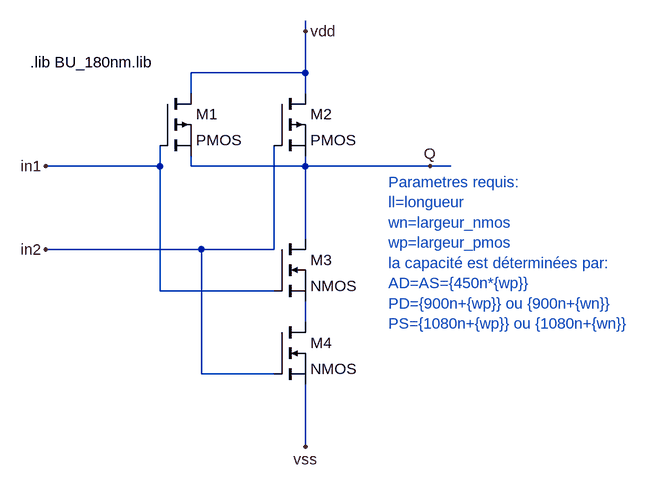
[diagram p0: schematic nand.asc]
nand.asc, the LTspice schematic file:
Version 4
SHEET 1 1192 980
WIRE 448 160 448 144
WIRE 448 224 448 160
WIRE 448 224 272 224
WIRE 272 256 272 224
WIRE 448 256 448 224
WIRE 224 368 224 336
WIRE 224 368 48 368
WIRE 272 368 272 352
WIRE 448 368 448 352
WIRE 448 368 272 368
WIRE 640 368 448 368
WIRE 672 368 640 368
WIRE 448 480 448 368
WIRE 288 496 48 496
WIRE 400 496 400 336
WIRE 400 496 288 496
WIRE 224 560 224 368
WIRE 400 560 224 560
WIRE 448 608 448 576
WIRE 288 688 288 496
WIRE 400 688 288 688
WIRE 448 800 448 704
FLAG 448 160 vdd
FLAG 448 800 vss
FLAG 640 368 Q
FLAG 48 368 in1
FLAG 48 496 in2
SYMBOL pmos 224 256 R0
SYMATTR InstName M1
SYMBOL pmos 400 256 R0
SYMATTR InstName M2
SYMBOL nmos 400 480 R0
SYMATTR InstName M3
SYMBOL nmos 400 608 R0
SYMATTR InstName M4
TEXT 24 208 Left 2 !.lib BU_180nm.lib
TEXT 576 392 Left 2 ;Parametres requis: \nll=longueur \nwn=largeur_nmos \nwp=largeur_pmos\nla capacité est déterminées par:     \nAD=AS={450n*{wp}}\nPD={900n+{wp}} ou {900n+{wn}}\nPS={1080n+{wp}} ou {1080n+{wn}}

The netlist it stands for:
* nand.asc
M1 vdd in1 Q Q PMOS
M2 vdd in2 Q Q PMOS
M3 Q in1 N001 N001 NMOS
M4 N001 in2 vss vss NMOS
.model NMOS NMOS
.model PMOS PMOS
.lib standard.mos
.lib BU_180nm.lib
* Parametres requis:
* ll=longueur
* wn=largeur_nmos
* wp=largeur_pmos
* la capacité est déterminées par:
* AD=AS={450n*{wp}}
* PD={900n+{wp}} ou {900n+{wn}}
* PS={1080n+{wp}} ou {1080n+{wn}}
.backanno
.end